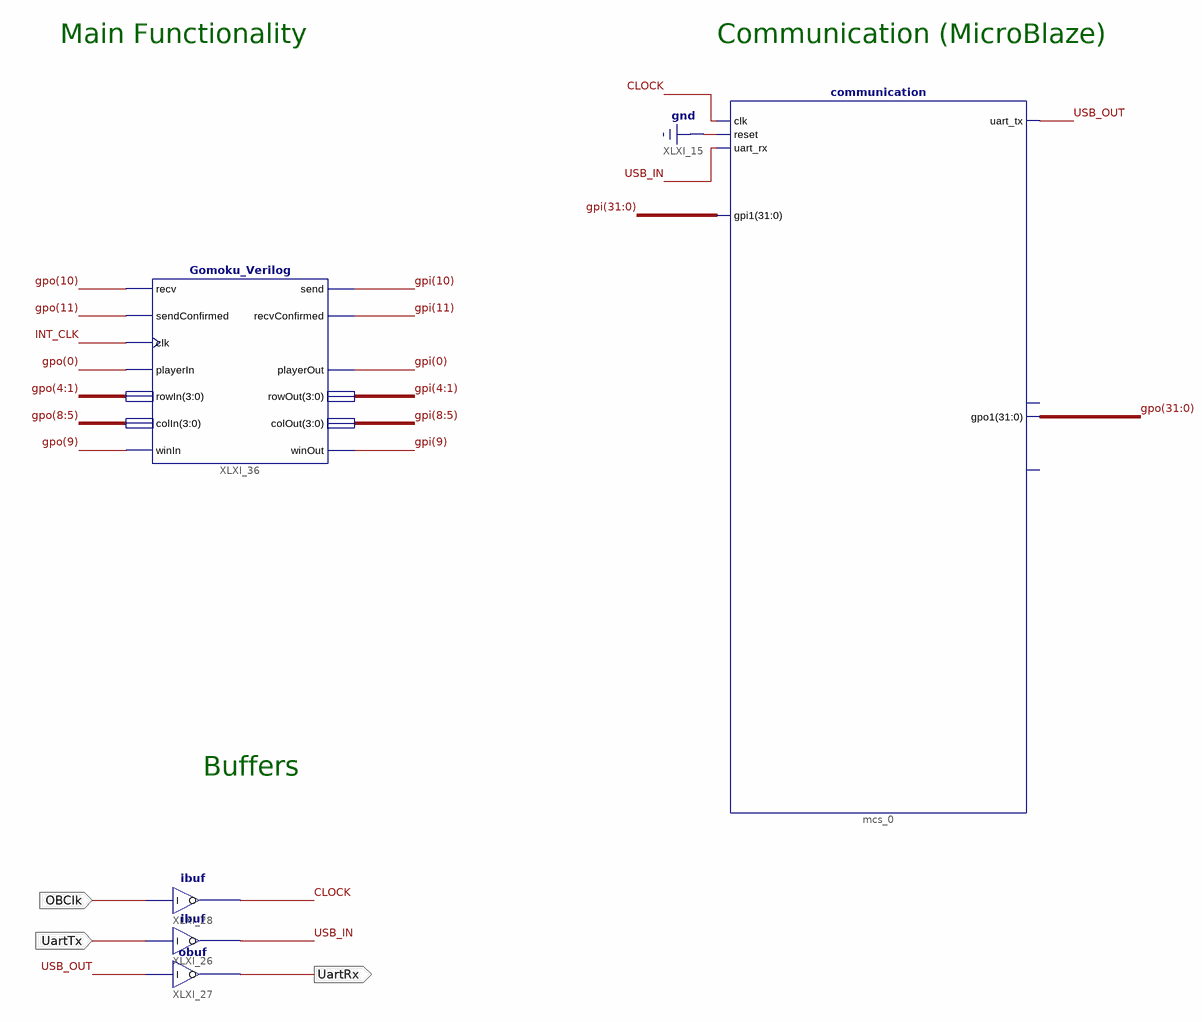
[diagram p0: schematic sheet 1]
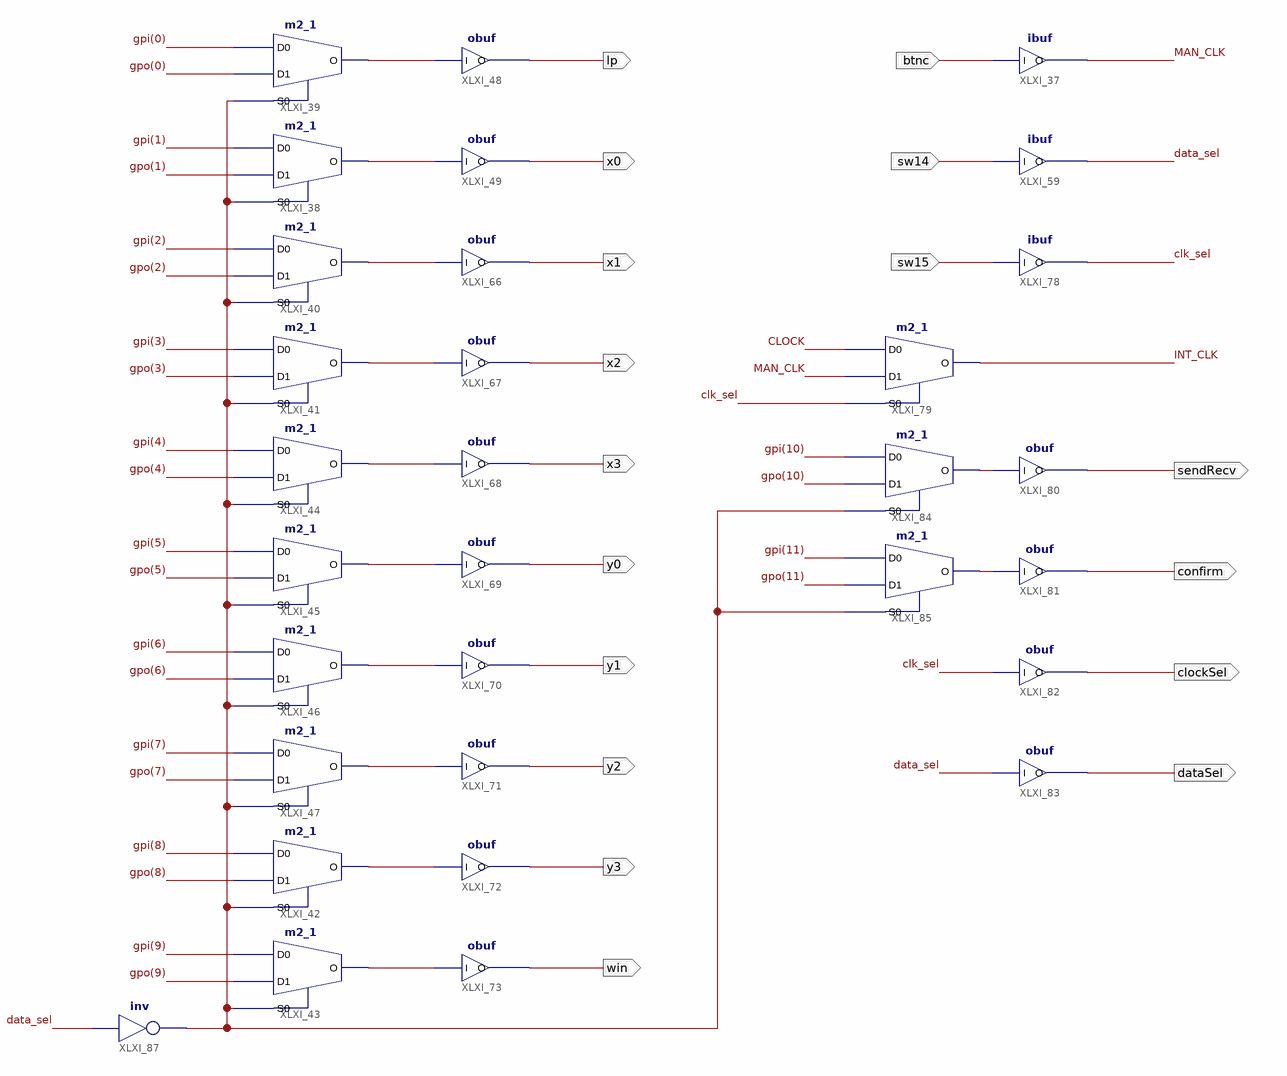
[diagram p1: schematic sheet 2]
// Xilinx ISE schematic gomoku.sch (artix7) as structural Verilog: 36 symbols, 20 ports
module gomoku (
  input  OBClk,
  input  UartTx,
  input  btnc,
  input  sw14,
  input  sw15,
  output UartRx,
  output lp,
  output x0,
  output x1,
  output x2,
  output x3,
  output y0,
  output y1,
  output y2,
  output y3,
  output win,
  output sendRecv,
  output confirm,
  output clockSel,
  output dataSel
);

  wire clk_sel, CLOCK, data_sel, INT_CLK, MAN_CLK, USB_IN, USB_OUT, XLXN_94, XLXN_95, XLXN_96, XLXN_97,
       XLXN_98, XLXN_99, XLXN_100, XLXN_101, XLXN_102, XLXN_103, XLXN_153, XLXN_154, XLXN_163;
  wire [31:0] gpi, gpo;

  ibuf XLXI_26 (.I(UartTx), .O(USB_IN));
  obuf XLXI_27 (.I(USB_OUT), .O(UartRx));
  ibuf XLXI_28 (.I(OBClk), .O(CLOCK));
  communication mcs_0 (
    .clk(CLOCK), .reset(1'b0), .uart_tx(USB_OUT), .uart_rx(USB_IN), .gpi1(gpi), .gpo1(gpo));  // open: uart_interrupt, intc_irq
  Gomoku_Verilog XLXI_36 (
    .playerIn(gpo[0]), .rowIn(gpo[4:1]), .colIn(gpo[8:5]), .winIn(gpo[9]), .playerOut(gpi[0]),
    .rowOut(gpi[4:1]), .colOut(gpi[8:5]), .winOut(gpi[9]), .clk(INT_CLK), .sendConfirmed(gpo[11]),
    .recv(gpo[10]), .recvConfirmed(gpi[11]), .send(gpi[10]));
  m2_1 XLXI_38 (.D0(gpi[1]), .D1(gpo[1]), .S0(XLXN_163), .O(XLXN_95));
  m2_1 XLXI_39 (.D0(gpi[0]), .D1(gpo[0]), .S0(XLXN_163), .O(XLXN_94));
  m2_1 XLXI_40 (.D0(gpi[2]), .D1(gpo[2]), .S0(XLXN_163), .O(XLXN_96));
  m2_1 XLXI_41 (.D0(gpi[3]), .D1(gpo[3]), .S0(XLXN_163), .O(XLXN_97));
  m2_1 XLXI_42 (.D0(gpi[8]), .D1(gpo[8]), .S0(XLXN_163), .O(XLXN_102));
  m2_1 XLXI_43 (.D0(gpi[9]), .D1(gpo[9]), .S0(XLXN_163), .O(XLXN_103));
  m2_1 XLXI_44 (.D0(gpi[4]), .D1(gpo[4]), .S0(XLXN_163), .O(XLXN_98));
  m2_1 XLXI_45 (.D0(gpi[5]), .D1(gpo[5]), .S0(XLXN_163), .O(XLXN_99));
  m2_1 XLXI_46 (.D0(gpi[6]), .D1(gpo[6]), .S0(XLXN_163), .O(XLXN_100));
  m2_1 XLXI_47 (.D0(gpi[7]), .D1(gpo[7]), .S0(XLXN_163), .O(XLXN_101));
  obuf XLXI_48 (.I(XLXN_94), .O(lp));
  obuf XLXI_49 (.I(XLXN_95), .O(x0));
  obuf XLXI_66 (.I(XLXN_96), .O(x1));
  obuf XLXI_67 (.I(XLXN_97), .O(x2));
  obuf XLXI_68 (.I(XLXN_98), .O(x3));
  obuf XLXI_69 (.I(XLXN_99), .O(y0));
  obuf XLXI_70 (.I(XLXN_100), .O(y1));
  obuf XLXI_71 (.I(XLXN_101), .O(y2));
  obuf XLXI_72 (.I(XLXN_102), .O(y3));
  obuf XLXI_73 (.I(XLXN_103), .O(win));
  m2_1 XLXI_79 (.D0(CLOCK), .D1(MAN_CLK), .S0(clk_sel), .O(INT_CLK));
  obuf XLXI_80 (.I(XLXN_153), .O(sendRecv));
  obuf XLXI_81 (.I(XLXN_154), .O(confirm));
  m2_1 XLXI_85 (.D0(gpi[11]), .D1(gpo[11]), .S0(XLXN_163), .O(XLXN_154));
  m2_1 XLXI_84 (.D0(gpi[10]), .D1(gpo[10]), .S0(XLXN_163), .O(XLXN_153));
  obuf XLXI_82 (.I(clk_sel), .O(clockSel));
  obuf XLXI_83 (.I(data_sel), .O(dataSel));
  ibuf XLXI_37 (.I(btnc), .O(MAN_CLK));
  ibuf XLXI_59 (.I(sw14), .O(data_sel));
  ibuf XLXI_78 (.I(sw15), .O(clk_sel));
  not XLXI_87 (XLXN_163, data_sel);

  // Notes on the sheet:
  //   Main Functionality
  //   Communication (MicroBlaze)
  //   Buffers
endmodule
